# Altium schematic sheet Sheet_1_2021-06-26.schdoc
size 436 x 305 mm
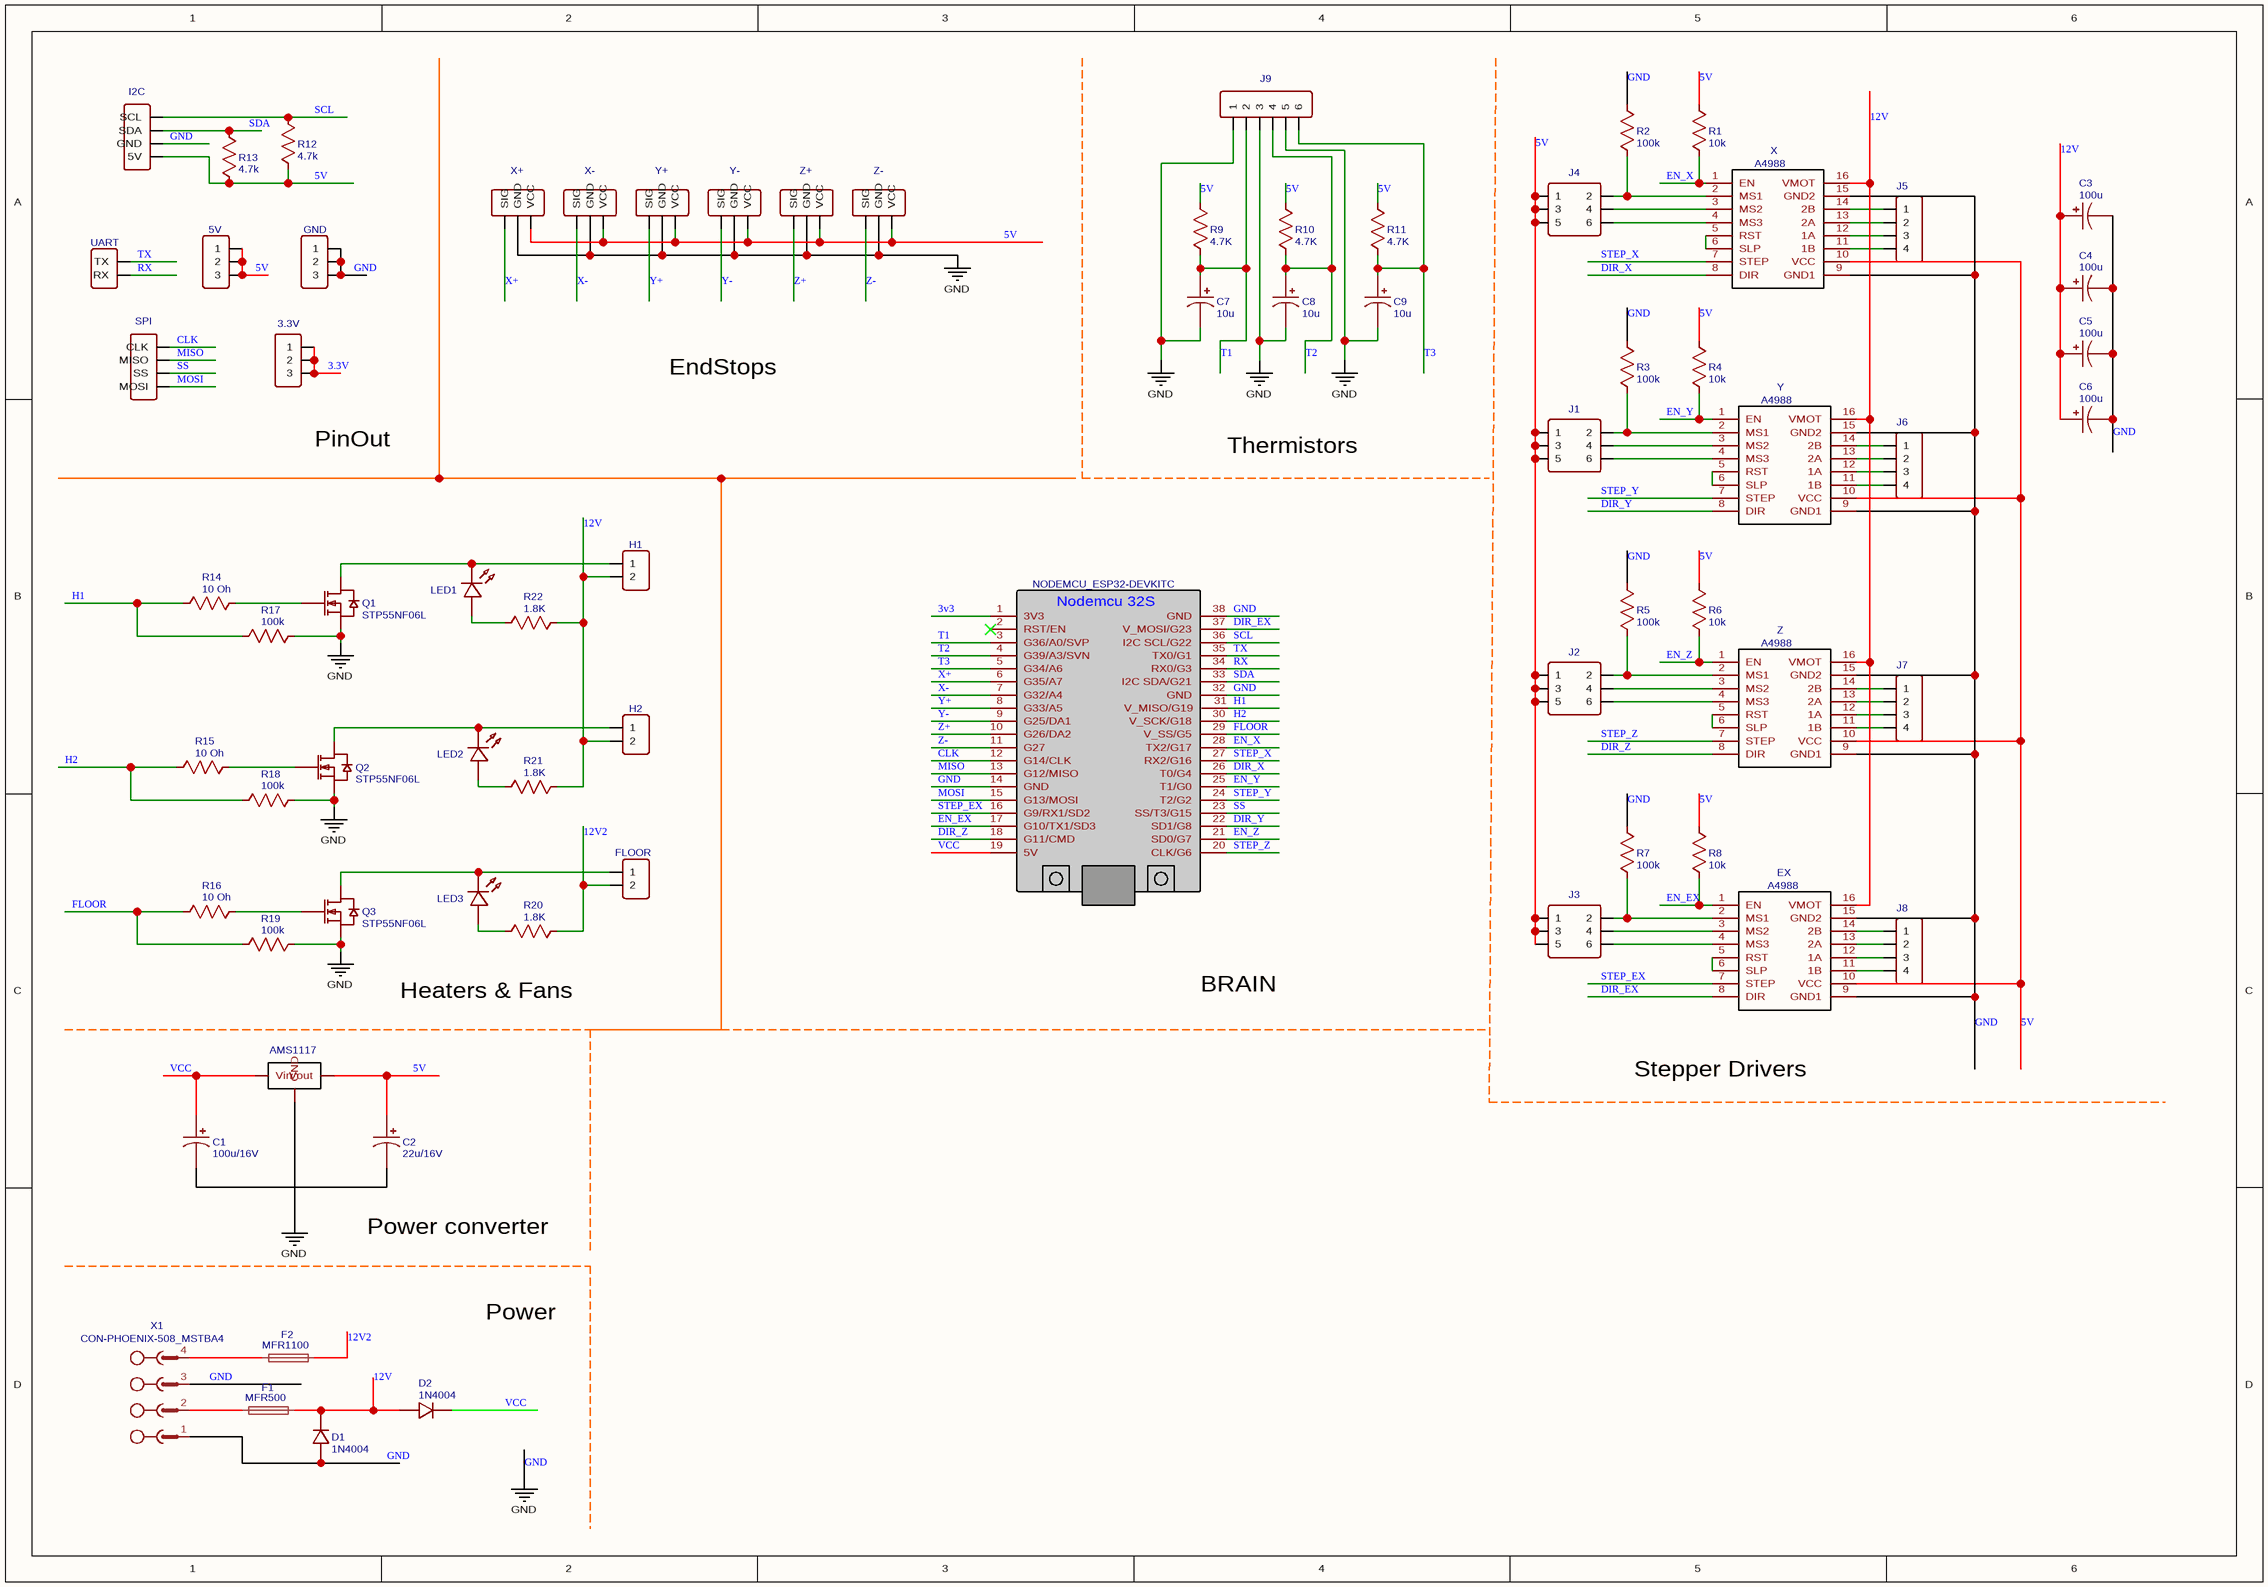
[diagram p0: Sheet_1_2021-06-26.schdoc]

## Parts
3.3V  HDR-M-2.54_1x3  [HDR-M-2.54_1X3]  (value not drawn)
5V  HDR-M-2.54_1x3  [HDR-M-2.54_1X3]  (value not drawn)
C1  100u/16V  [CASE-A_3216]
C2  22u/16V  [CASE-A_3216]
C3  100u  [CAP-D8.0×F3.5]
C4  100u  [CAP-D8.0×F3.5]
C5  100u  [CAP-D8.0×F3.5]
C6  100u  [CAP-D8.0×F3.5]
C7  10u  [CAP-D8.0×F3.5]
C8  10u  [CAP-D8.0×F3.5]
C9  10u  [CAP-D8.0×F3.5]
D1  1N4004  [DIODE LEAD SP 11MM]
D2  1N4004  [DIODE LEAD SP 11MM]
EX  A4988  [A4988 STEPPER MOTOR DRIVER CARRIER]
F1  MFR500  [MFR500]
F2  MFR1100  [MFR1100]
FLOOR  CONN-TH_2P-P5.08  [CONN-TH_2P-P5.08]  (value not drawn)
GND  HDR-M-2.54_1x3  [HDR-M-2.54_1X3]  (value not drawn)
H1  CONN-TH_2P-P5.08  [CONN-TH_2P-P5.08]  (value not drawn)
H2  CONN-TH_2P-P5.08  [CONN-TH_2P-P5.08]  (value not drawn)
I2C  HDR-M-2.54_1x4  [HDR-M-2.54_1X4]  (value not drawn)
J1  HDR-M-2.54_2x3  [HDR-M-2.54_2X3]  (value not drawn)
J2  HDR-M-2.54_2x3  [HDR-M-2.54_2X3]  (value not drawn)
J3  HDR-M-2.54_2x3  [HDR-M-2.54_2X3]  (value not drawn)
J4  HDR-M-2.54_2x3  [HDR-M-2.54_2X3]  (value not drawn)
J5  HDR-M-2.54_1x4  [HDR-M-2.54_1X4]  (value not drawn)
J6  HDR-M-2.54_1x4  [HDR-M-2.54_1X4]  (value not drawn)
J7  HDR-M-2.54_1x4  [HDR-M-2.54_1X4]  (value not drawn)
J8  HDR-M-2.54_1x4  [HDR-M-2.54_1X4]  (value not drawn)
J9  HDR-M-2.54_1x6  [HDR-M-2.54_1X6]  (value not drawn)
LED1  LED-0603_R  [LED0603_RED]  (value not drawn)
LED2  LED-0603_R  [LED0603_RED]  (value not drawn)
LED3  LED-0603_R  [LED0603_RED]  (value not drawn)
Q1  STP55NF06L  [TO-220-3_L10.0-W4.5-P2.54-L]
Q2  STP55NF06L  [TO-220-3_L10.0-W4.5-P2.54-L]
Q3  STP55NF06L  [TO-220-3_L10.0-W4.5-P2.54-L]
R1  10k  [R0603]
R2  100k  [R0603]
R3  100k  [R0603]
R4  10k  [R0603]
R5  100k  [R0603]
R6  10k  [R0603]
R7  100k  [R0603]
R8  10k  [R0603]
R9  4.7K  [R0603]
R10  4.7K  [R0603]
R11  4.7K  [R0603]
R12  4.7k  [R0603]
R13  4.7k  [R0603]
R14  10 Oh  [R0603]
R15  10 Oh  [R0603]
R16  10 Oh  [R0603]
R17  100k  [R0603]
R18  100k  [R0603]
R19  100k  [R0603]
R20  1.8K  [R0603]
R21  1.8K  [R0603]
R22  1.8K  [R0603]
SPI  HDR-M-2.54_1x4  [HDR-M-2.54_1X4]  (value not drawn)
U1  NODEMCU_ESP32-DEVKITC  [NODEMCU-ESP32S]
U3  AMS1117  [AMS1117]
UART  HDR-M-2.54_1x2  [HDR-M-2.54_1X2]  (value not drawn)
X  A4988  [A4988 STEPPER MOTOR DRIVER CARRIER]
X1  CON-PHOENIX-508_MSTBA4  [MSTBA4]
X+  HDR-M-2.54_1x3  [HDR-M-2.54_1X3]  (value not drawn)
X-  HDR-M-2.54_1x3  [HDR-M-2.54_1X3]  (value not drawn)
Y  A4988  [A4988 STEPPER MOTOR DRIVER CARRIER]
Y+  HDR-M-2.54_1x3  [HDR-M-2.54_1X3]  (value not drawn)
Y-  HDR-M-2.54_1x3  [HDR-M-2.54_1X3]  (value not drawn)
Z  A4988  [A4988 STEPPER MOTOR DRIVER CARRIER]
Z+  HDR-M-2.54_1x3  [HDR-M-2.54_1X3]  (value not drawn)
Z-  HDR-M-2.54_1x3  [HDR-M-2.54_1X3]  (value not drawn)

## Nets
GND: C3.2 C4.2 C5.2 C6.2 C7.2 C8.2 C9.2 D1.A EX.9(GND1) EX.15(GND2) GND.1 GND.2 GND.3 I2C.3(GND) J9.1 J9.3 J9.5 Q1.3(S) Q2.3(S) Q3.3(S) R2.2 R3.2 R5.2 R7.2 R17.2 R18.2 R19.2 U1.14(GND) U1.32(GND) U1.38(GND) U3.1(GND) X.9(GND1) X.15(GND2) X1.1 X1.3 X+.2(GND) X-.2(GND) Y.9(GND1) Y.15(GND2) Y+.2(GND) Y-.2(GND) Z.9(GND1) Z.15(GND2) Z+.2(GND) Z-.2(GND)
3.3V: 3.3V.1 3.3V.2 3.3V.3
3v3: U1.1(3V3)
5V: 5V.1 5V.2 5V.3 C2.1 EX.10(VCC) I2C.4(5V) J1.1 J1.3 J1.5 J2.1 J2.3 J2.5 J3.1 J3.3 J3.5 J4.1 J4.3 J4.5 R1.2 R4.2 R6.2 R8.2 R9.2 R10.2 R11.2 R12.1 R13.1 U3.2(Vout) X.10(VCC) X+.3(VCC) X-.3(VCC) Y.10(VCC) Y+.3(VCC) Y-.3(VCC) Z.10(VCC) Z+.3(VCC) Z-.3(VCC)
12V: C3.1 C4.1 C5.1 C6.1 D1.C D2.A EX.16(VMOT) F1.2 H1.2 H2.2 R21.2 R22.2 X.16(VMOT) Y.16(VMOT) Z.16(VMOT)
12V2: F2.2 FLOOR.2 R20.2
CLK: SPI.1(CLK) U1.12(G14/CLK)
DIR_EX: EX.8(DIR) U1.37(V_MOSI/G23)
DIR_X: U1.26(T0/G4) X.8(DIR)
DIR_Y: U1.22(SD1/G8) Y.8(DIR)
DIR_Z: U1.18(G11/CMD) Z.8(DIR)
EN_EX: EX.1(EN) R8.1 U1.17(G10/TX1/SD3)
EN_X: R1.1 U1.28(TX2/G17) X.1(EN)
EN_Y: R4.1 U1.25(T1/G0) Y.1(EN)
EN_Z: R6.1 U1.21(SD0/G7) Z.1(EN)
FLOOR: R16.1 R19.1 U1.29(V_SS/G5)
H1: R14.1 R17.1 U1.31(V_MISO/G19)
H2: R15.1 R18.1 U1.30(V_SCK/G18)
MISO: SPI.2(MISO) U1.13(G12/MISO)
MOSI: SPI.4(MOSI) U1.15(G13/MOSI)
RX: U1.34(RX0/G3) UART.2(RX)
SCL: I2C.1(SCL) R12.2 U1.36(I2C_SCL/G22)
SDA: I2C.2(SDA) R13.2 U1.33(I2C_SDA/G21)
SS: SPI.3(SS) U1.23(SS/T3/G15)
STEP_EX: EX.7(STEP) U1.16(G9/RX1/SD2)
STEP_X: U1.27(RX2/G16) X.7(STEP)
STEP_Y: U1.24(T2/G2) Y.7(STEP)
STEP_Z: U1.20(CLK/G6) Z.7(STEP)
T1: C7.1 J9.2 R9.1 U1.3(G36/A0/SVP)
T2: C8.1 J9.4 R10.1 U1.4(G39/A3/SVN)
T3: C9.1 J9.6 R11.1 U1.5(G34/A6)
TX: U1.35(TX0/G1) UART.1(TX)
VCC: C1.1 D2.C U1.19(5V) U3.3(Vin)
X+: U1.6(G35/A7) X+.1(SIG)
X-: U1.7(G32/A4) X-.1(SIG)
Y+: U1.8(G33/A5) Y+.1(SIG)
Y-: U1.9(G25/DA1) Y-.1(SIG)
Z+: U1.10(G26/DA2) Z+.1(SIG)
Z-: U1.11(G27) Z-.1(SIG)
NetC1_2: C1.2 C2.2
NetEX_2: EX.2(MS1) J3.2 R7.1
NetEX_3: EX.3(MS2) J3.4
NetEX_4: EX.4(MS3) J3.6
NetEX_5: EX.5(RST) EX.6(SLP)
NetEX_11: EX.11(1B) J8.4
NetEX_12: EX.12(1A) J8.3
NetEX_13: EX.13(2A) J8.2
NetEX_14: EX.14(2B) J8.1
NetF1_1: F1.1 X1.2
NetF2_1: F2.1 X1.4
NetFLOOR_1: FLOOR.1 LED3.2 Q3.2(D)
NetH1_1: H1.1 LED1.2 Q1.2(D)
NetH2_1: H2.1 LED2.2 Q2.2(D)
NetJ1_2: J1.2 R3.1 Y.2(MS1)
NetJ1_4: J1.4 Y.3(MS2)
NetJ1_6: J1.6 Y.4(MS3)
NetJ2_2: J2.2 R5.1 Z.2(MS1)
NetJ2_4: J2.4 Z.3(MS2)
NetJ2_6: J2.6 Z.4(MS3)
NetJ4_2: J4.2 R2.1 X.2(MS1)
NetJ4_4: J4.4 X.3(MS2)
NetJ4_6: J4.6 X.4(MS3)
NetJ5_1: J5.1 X.14(2B)
NetJ5_2: J5.2 X.13(2A)
NetJ5_3: J5.3 X.12(1A)
NetJ5_4: J5.4 X.11(1B)
NetJ6_1: J6.1 Y.14(2B)
NetJ6_2: J6.2 Y.13(2A)
NetJ6_3: J6.3 Y.12(1A)
NetJ6_4: J6.4 Y.11(1B)
NetJ7_1: J7.1 Z.14(2B)
NetJ7_2: J7.2 Z.13(2A)
NetJ7_3: J7.3 Z.12(1A)
NetJ7_4: J7.4 Z.11(1B)
NetLED1_1: LED1.1 R22.1
NetLED2_1: LED2.1 R21.1
NetLED3_1: LED3.1 R20.1
NetQ1_1: Q1.1(G) R14.2
NetQ2_1: Q2.1(G) R15.2
NetQ3_1: Q3.1(G) R16.2
NetX_5: X.5(RST) X.6(SLP)
NetY_5: Y.5(RST) Y.6(SLP)
NetZ_5: Z.5(RST) Z.6(SLP)

Not connected (* = marked no-connect by the designer): U1 2(RST/EN)*

## Notes on the sheet
- EndStops
- PinOut
- Thermistors
- Heaters & Fans
- BRAIN
- Stepper Drivers
- Рower converter
- Power
- (in symbol NODEMCU_ESP32-DEVKITC) Nodemcu 32S

## Library data of the parts
3.3V 5V GND X+ X- Y+ Y- Z+ Z- = HDR-M-2.54_1x3: Contributor: LCEDA_Lib; BOM_Supplier Part: C180248; BOM_Supplier: LCSC; spicePre: J; spiceSymbolName: HDR-M-2.54_1x3
C1 = 100u/16V: nameAlias: Value(F); Contributor: LCEDA_Lib; spicePre: C; spiceSymbolName: C_Tan_SMD_A_US
C2 = 22u/16V: nameAlias: Value(F); Contributor: LCEDA_Lib; spicePre: C; spiceSymbolName: C_Tan_SMD_A_US
C3-C6 = 100u: nameAlias: Value(F); Contributor: LCEDA_Lib; spicePre: C; spiceSymbolName: CE_TH_D8.0×F3.5_US
C7-C9 = 10u: nameAlias: Value(F); Contributor: LCEDA_Lib; spicePre: C; spiceSymbolName: CE_TH_D8.0×F3.5_US
D1 D2 = 1N4004: BOM_Manufacturer: SEMTECH; BOM_Manufacturer Part: 1N4448; Contributor: HICOCO; BOM_Supplier: LCSC; image: //image.lceda.cn/szlcsc/C54037.jpg; BOM_Supplier Part: C54037; spicePre: D; spiceSymbolName: 1N4004
EX X Y Z = A4988: Contributor: Shiposha; BOM_Manufacturer Part: A4988; spicePre: U; spiceSymbolName: A4988
F1 = MFR500: Contributor: DowntownCB; spicePre: F; spiceSymbolName: PTCFUSE
F2 = MFR1100: Contributor: DowntownCB; spicePre: F; spiceSymbolName: PTCFUSEMFR1100
FLOOR H1 H2 = CONN-TH_2P-P5.08: Contributor: LCEDA_Lib; BOM_Supplier: LCSC; spicePre: P; spiceSymbolName: CONN-TH_2P-P5.08
I2C J5-J8 SPI = HDR-M-2.54_1x4: Contributor: LCEDA_Lib; BOM_Supplier Part: C124378; BOM_Supplier: LCSC; spicePre: J; spiceSymbolName: HDR-M-2.54_1x4
J1-J4 = HDR-M-2.54_2x3: Contributor: LCEDA_Lib; BOM_Supplier Part: C65114; BOM_Supplier: LCSC; spicePre: J; spiceSymbolName: HDR-M-2.54_2x3
J9 = HDR-M-2.54_1x6: Contributor: LCEDA_Lib; BOM_Supplier Part: C190819; BOM_Supplier: LCSC; spicePre: J; spiceSymbolName: HDR-M-2.54_1x6
LED1-LED3 = LED-0603_R: BOM_Manufacturer: EVERLIGHT(台湾亿光); BOM_Manufacturer Part: 19-217/R6C-AL1M2VY/3T; Contributor: LCEDA_01; BOM_Supplier Part: C72044; BOM_Supplier: LCSC; spicePre: L; spiceSymbolName: LED-0603_R
Q1-Q3 = STP55NF06L: BOM_Manufacturer: STMicroelectronics; BOM_Supplier: LCSC; BOM_Manufacturer Part: STP55NF06L; BOM_Supplier Part: C77582; BOM_JLCPCB Part Class: Extended Part; spicePre: Q; spiceSymbolName: STP55NF06L
R1 R4 R6 R8 = 10k: nameAlias: Value(Ω); Contributor: LCEDA_Lib; spicePre: R; spiceSymbolName: R_0603_US
R2 R3 R5 R7 R17-R19 = 100k: nameAlias: Value(Ω); Contributor: LCEDA_Lib; spicePre: R; spiceSymbolName: R_0603_US
R9-R11 = 4.7K: nameAlias: Value(Ω); Contributor: LCEDA_Lib; spicePre: R; spiceSymbolName: R_0603_US
R12 R13 = 4.7k: nameAlias: Value(Ω); Contributor: LCEDA_Lib; spicePre: R; spiceSymbolName: R_0603_US
R14-R16 = 10 Oh: nameAlias: Value(Ω); Contributor: LCEDA_Lib; spicePre: R; spiceSymbolName: R_0603_US
R20-R22 = 1.8K: nameAlias: Value(Ω); Contributor: LCEDA_Lib; spicePre: R; spiceSymbolName: R_0603_US
U1 = NODEMCU_ESP32-DEVKITC: BOM_Manufacturer Part: NodeMCU ESP32S-----; Contributor: andzej.telican; spicePre: U; spiceSymbolName: NODEMCU_ESP32-DEVKITC
U3 = AMS1117: Contributor: Gremlinware; BOM_Supplier: Amish; BOM_Supplier Part: HLK-PM01; spicePre: U; spiceSymbolName: AMS1117
UART = HDR-M-2.54_1x2: Contributor: LCEDA_Lib; BOM_Supplier Part: C124375; BOM_Supplier: LCSC; spicePre: J; spiceSymbolName: HDR-M-2.54_1x2
X1 = CON-PHOENIX-508_MSTBA4: Contributor: Funny Leon; description: PHOENIX; timeStamp: 1475049925; spicePre: X; spiceSymbolName: CON-PHOENIX-508_MSTBA4